# EAGLE schematic untitled (EAGLE 9.6.2)
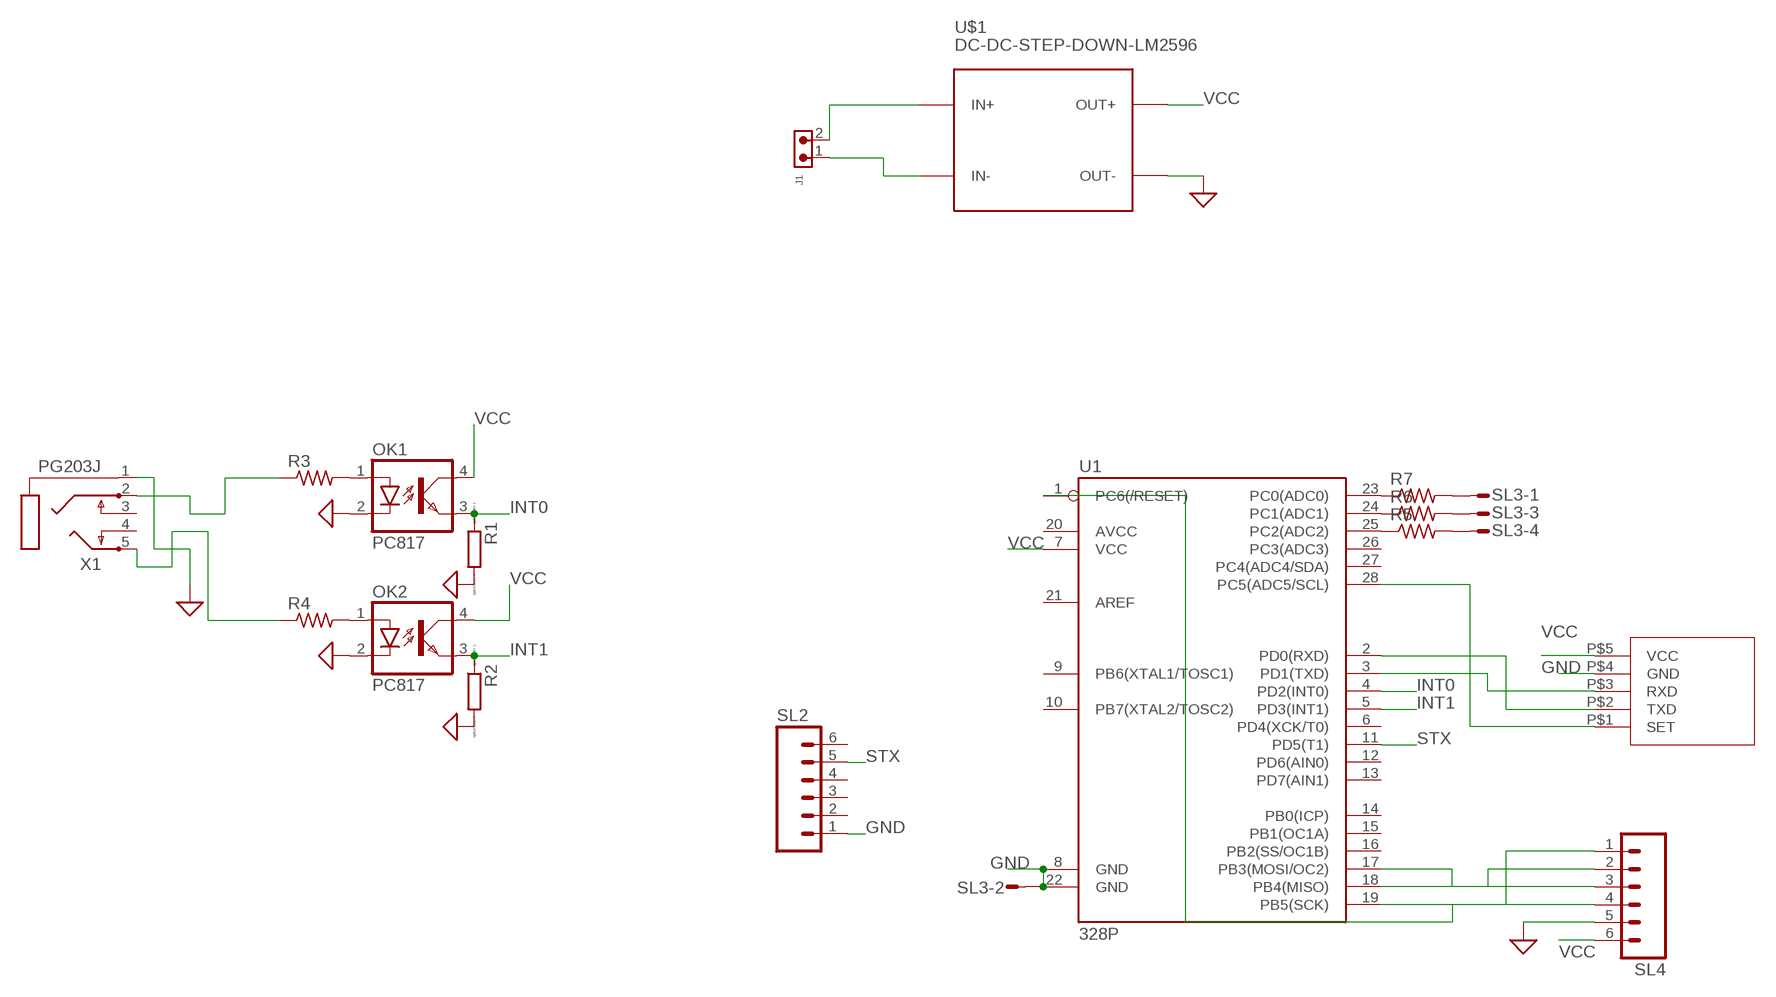
[diagram p0: schematic, sheet 1]

## Parts
J1  691305530002  [691305530002]
OK1  PC817  [DIL04]
OK2  PC817  [DIL04]
R1  R0207/10  [0207/10]
R2  R0207/10  [0207/10]
R3  R-US_0207/10  [0207/10]
R4  R-US_0207/10  [0207/10]
R5  R-US_0204/2V  [0204V]
R6  R-US_0204/2V  [0204V]
R7  R-US_0207/7  [0207/7]
SL2  M06  [06P]
SL3  M04S  [04P]
SL4  M06  [06P]
U1  328P  ATMEGA328P_PDIP  [DIP28]
U$1  DC-DC-STEP-DOWN-LM2596  [DC-DC-STEP-DOWN-LM2596]
U$3  HC12  [HC12]
X1  PG203J  [PG203J]

## Nets
GND: OK1.2(C) OK2.2(C) R1.2 R2.2 SL2.1 SL3.2 SL4.5 U1.8(GND) U1.22(GND) U$1.OUT- U$3.P$4(GND) X1.1 ; supply symbol labelled SUP
INT0: OK1.3(EMIT) R1.1 U1.4(PD2(INT0))
INT1: OK2.3(EMIT) R2.1 U1.5(PD3(INT1))
N$1: J1.2 U$1.IN+
N$2: J1.1 U$1.IN-
N$3: SL4.1 U1.19(PB5(SCK))
N$4: SL4.2 U1.18(PB4(MISO))
N$5: SL4.3 U1.17(PB3(MOSI/OC2))
N$6: SL4.4 U1.1(PC6(/RESET))
N$7: OK1.1(A) R3.2
N$8: OK2.1(A) R4.2
N$9: R3.1 X1.2
N$10: R4.1 X1.5
N$11: U1.2(PD0(RXD)) U$3.P$2(TXD)
N$12: U1.3(PD1(TXD)) U$3.P$3(RXD)
N$14: R5.1 U1.25(PC2(ADC2))
N$15: U1.28(PC5(ADC5/SCL)) U$3.P$1(SET)
N$16: R5.2 SL3.4
N$17: R6.1 U1.24(PC1(ADC1))
N$18: R6.2 SL3.3
N$19: R7.1 U1.23(PC0(ADC0))
N$20: R7.2 SL3.1
STX: SL2.5 U1.11(PD5(T1))
VCC: OK1.4(COL) OK2.4(COL) SL4.6 U1.7(VCC) U$1.OUT+ U$3.P$5(VCC)
Unconnected: SL2.2 SL2.3 SL2.4 SL2.6 U1.6(PD4(XCK/T0)) U1.9(PB6(XTAL1/TOSC1)) U1.10(PB7(XTAL2/TOSC2)) U1.12(PD6(AIN0)) U1.13(PD7(AIN1)) U1.14(PB0(ICP)) U1.15(PB1(OC1A)) U1.16(PB2(SS/OC1B)) U1.20(AVCC) U1.21(AREF) U1.26(PC3(ADC3)) U1.27(PC4(ADC4/SDA)) X1.3 X1.4

## Library data of the parts
J1 = Wurth_Connectors_WR-TBL Pluggable Connector:691305530002: WR-TBL Serie 3055 - 5,08 mm - PCB Header Vertical Entry with Plastic Latches KIND PROPERTIES Pitch 5.08 mm MATERIAL PROPERTIES Insulator Material PA66 Insulator Flammability Rating UL94 V-0 Insulator Color Green Terminal Material Copper Alloy Terminal Plating Tin-plated surface GENERAL INFORMATION Operating Temperature -40 up to +105 °C ELECTRICAL PROPERTIES IR UL 16 A Working Voltage [UL] 300 V (AC) Withstanding Voltage [UL] 2500 V (AC) Contact Resistance [UL] 20 mΩ CERTIFICATION UL Approval E315414 <https://www.we-online.com/catalog/media/o135349v209%20Family_WR-TBL3_6913055300xx.jpg> Details see: https://www.we-online.com/catalog/en/TBL_5_08_3055_6913055300XX/ Updated by Ella Wu 2019-12-30 2019(C) Wurth Elektronik; DATASHEET-URL: https://www.we-online.com/catalog/datasheet/691305530002.pdf; IR-UL: 16A; MOUNT: THT; PART-NUMBER: 691305530002; PINS: 2; PITCH: 5.08mm; TYPE: Vertical; WORKING-VOLTAGE-UL: 300V (AC)
OK1 OK2 = optocoupler:PC817: SHARP OPTO COUPLER; MPN: PC817X4J000F; OC_FARNELL: 9707727; OC_NEWARK: 97K7059
R1 R2 = eagle-ltspice:R: RESISTOR, European symbol; SPICEMODEL: NONE; SPICEPREFIX: R
R3-R7 = BeagleBone_Black_Wireless:R-US_: RESISTOR, American symbol
SL2 SL4 = con-amp-quick:M06: AMP QUICK CONNECTOR; OC_FARNELL: unknown; OC_NEWARK: unknown
SL3 = con-amp-quick:M04S: AMP QUICK CONNECTOR; OC_FARNELL: unknown; OC_NEWARK: unknown
U1 = SparkFun-IC-Microcontroller:ATMEGA328P_PDIP: Atmel 328P Through hole ATMEGA328P uC used in the Arduino 32kb flash, 1k EEPROM, 2k SRAM Datasheet <http://www.sparkfun.com/datasheets/Components/SMD/ATMega328.pdf> SparkFun Products Storefront component: AVR 28 Pin 20MHz 32K 6A/D - ATMega328P <https://www.sparkfun.com/products/9061> (COM-09061) SparkFun Simon Says - Through-Hole Soldering Kit <https://www.sparkfun.com/products/10547> (KIT-10547) SparkFun Learn to Solder - Simon Says <https://www.sparkfun.com/products/13708> (KIT-13708) SparkFun BigTime Watch Kit <https://www.sparkfun.com/products/11734> (KIT-11734) SparkFun ClockIt <https://www.sparkfun.com/products/10930> (KIT-10930) SparkFun Serial Enabled LCD Kit <https://www.sparkfun.com/products/10097> (LCD-10097) SparkFun Simon Tilts - Through Hole Soldering Kit <https://www.sparkfun.com/products/12634> (KIT-12634) SparkFun Frequency Counter Kit <https://www.sparkfun.com/products/10140> (KIT-10140) FabFM Radio Kit <https://www.sparkfun.com/products/11043> (KIT-11043) SparkFun Binary Blaster Kit <https://www.sparkfun.com/products/12037> (KIT-12037) SparkFun Metro-Gnome <https://www.sparkfun.com/products/9236> (KIT-09236) ATmega328 with Arduino Optiboot (Uno) <https://www.sparkfun.com/products/10524> (DEV-10524); PROD_ID: IC-09136
U$1 = diy-modules:DC-DC-STEP-DOWN-LM2596: DC/DC Step-Down Regulator based on LM2596-ADJ chip LM2596 datasheet available here: http://www.ti.com/lit/ds/symlink/lm2596.pdf Click here to find device on ebay.com <http://www.ebay.com/sch/lm2596+power+regulator>
U$3 = techart:HC12
X1 = con-hirschmann:PG203J: MIC/HEADPHONE JACK KS-S stereo microphone/headphone jack PG203JN (Schukat); OC_FARNELL: unknown; OC_NEWARK: unknown